# Altium schematic sheet FPGA.SchDoc: RNG RPI Interface
size 420 x 297 mm; Author: G.Kasprowicz; CompanyName: WUT ISE; DrawnBy: G.Kasprowicz; Organization: WUT ISE; Address1: PW ISE; Address2: Nowowiejska 15/19 00-665 Warsaw; Address3: gkasprow@gmail.com; Revision: 2; SheetNumber: -; SheetTotal: -; ModifiedBy: -; CheckedDate: -; Title2: FPGA banks; DivGrp: WUT ISE; Designer: G.Kasprowicz; ModifiedDate: -; ProjectName: Sensor Box
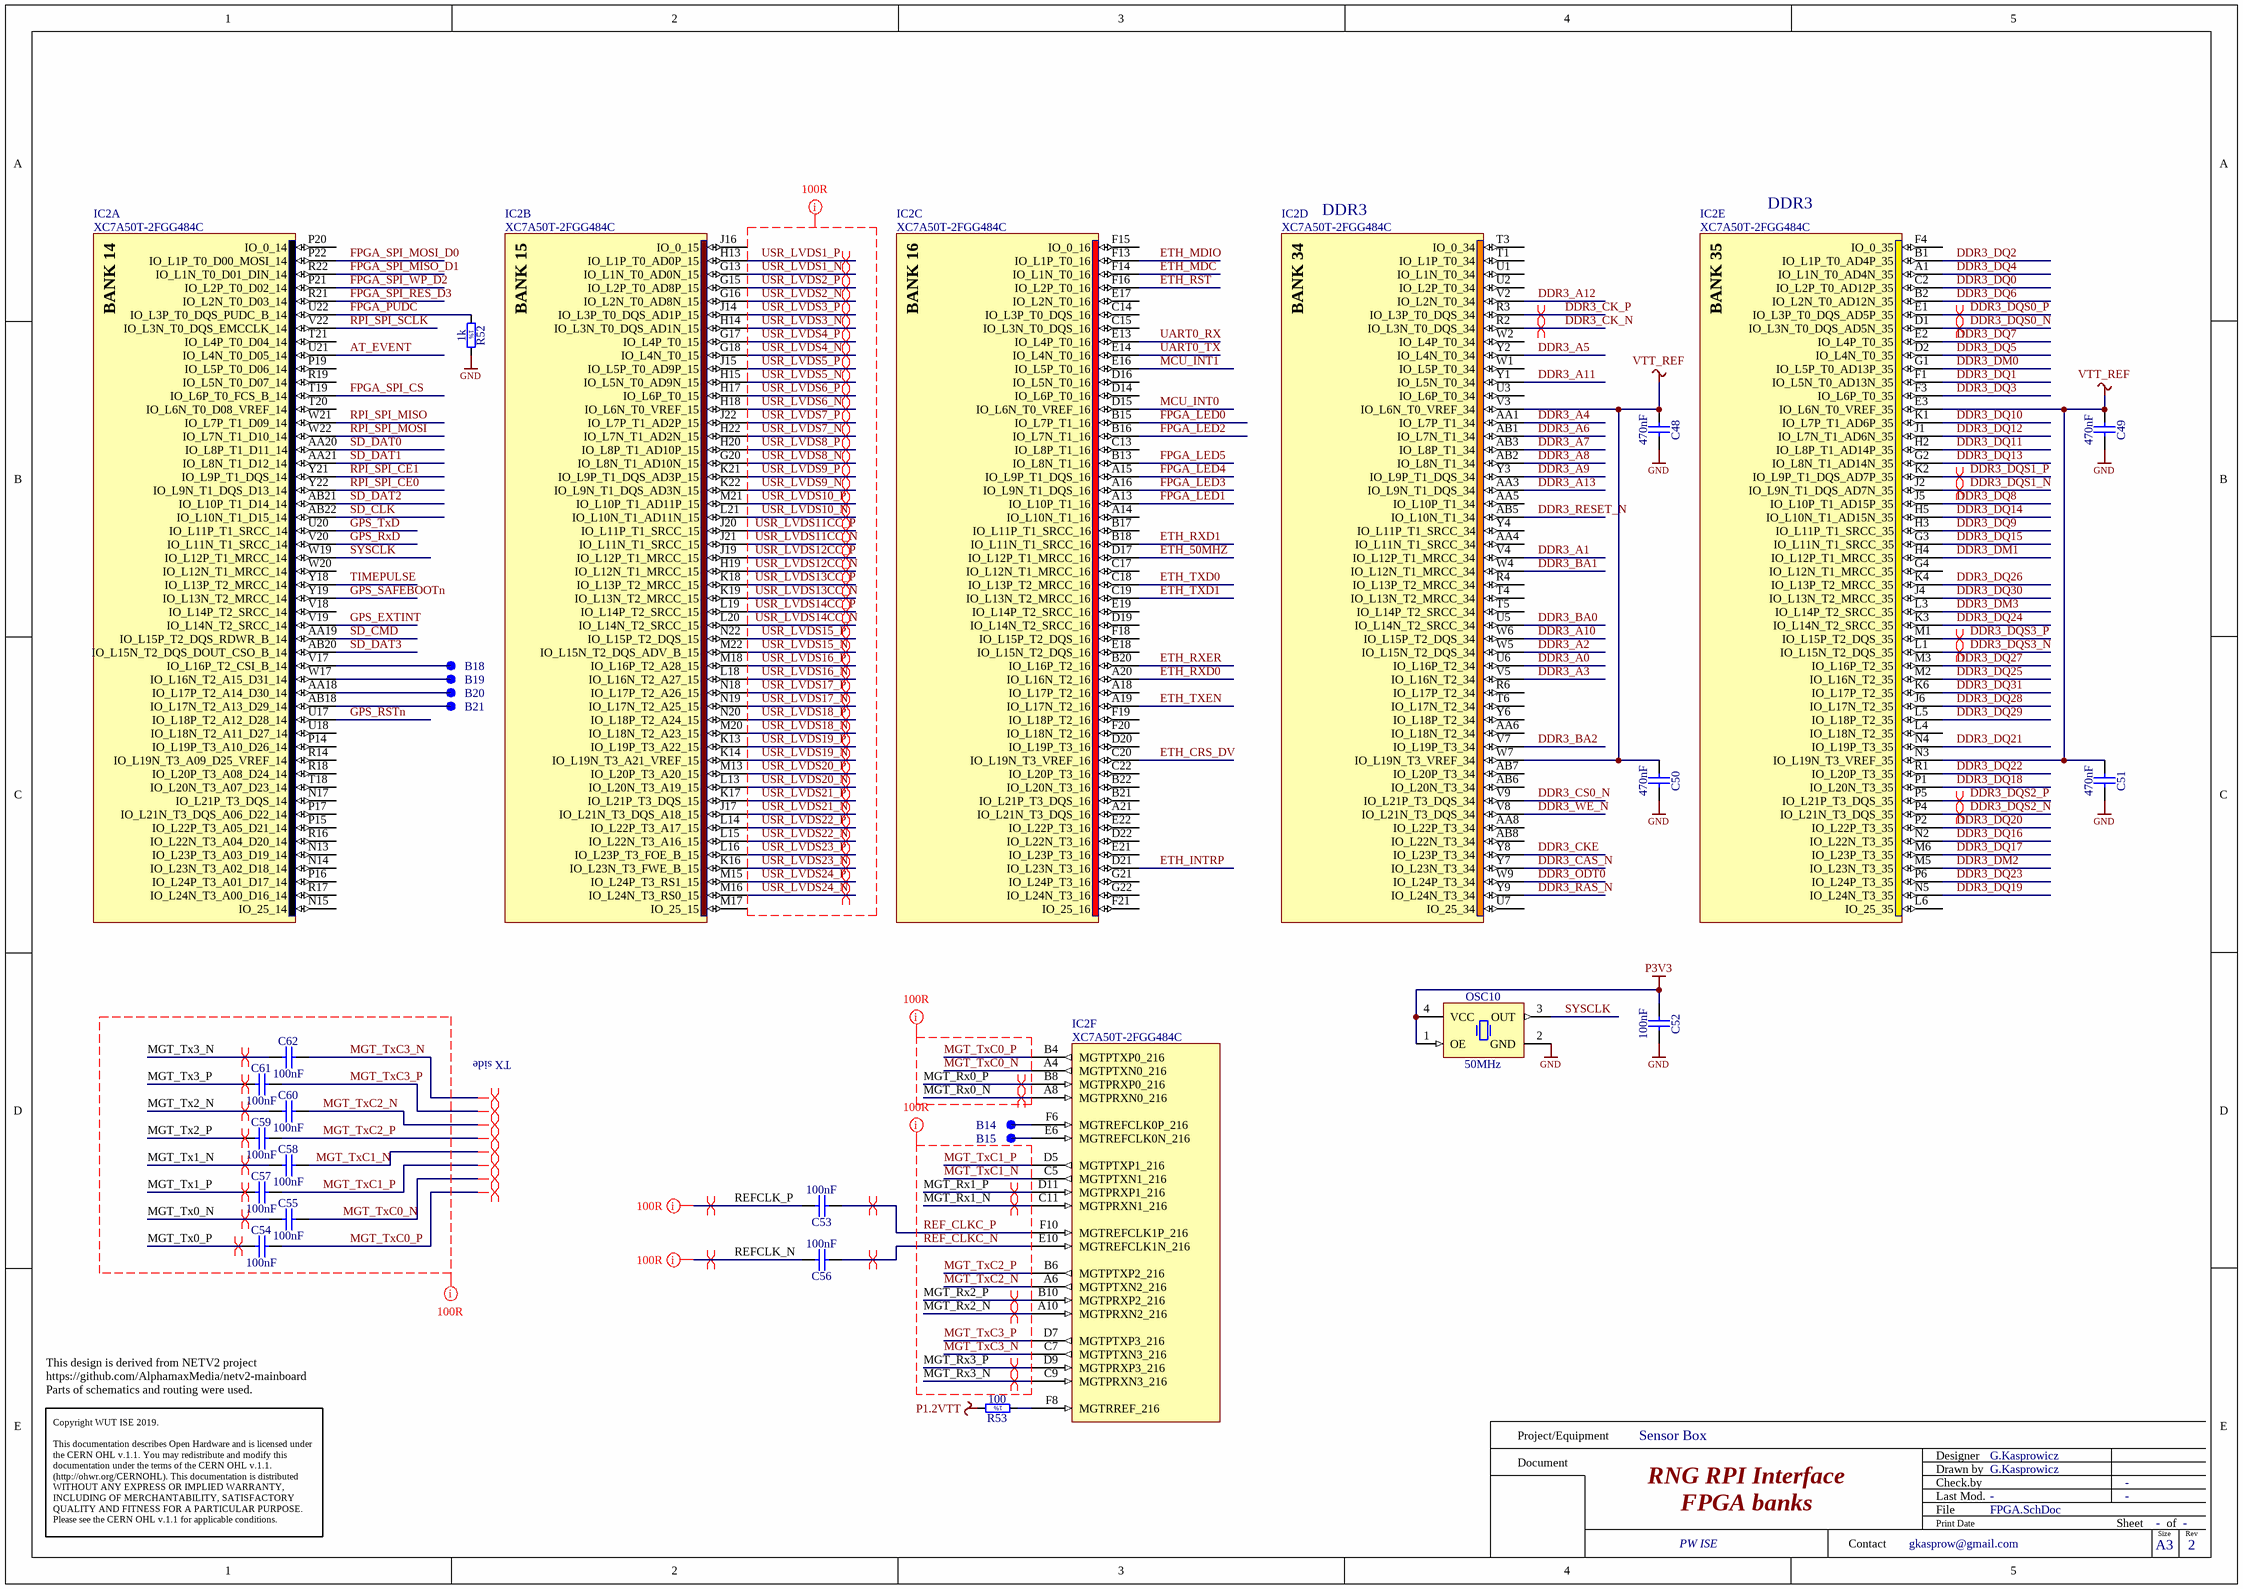
[diagram p0: FPGA.SchDoc]

## Parts
B14  SMD Pad  [C100]  (value not drawn)
B15  SMD Pad  [C100]  (value not drawn)
B18  SMD Pad  [C100]  (value not drawn)
B19  SMD Pad  [C100]  (value not drawn)
B20  SMD Pad  [C100]  (value not drawn)
B21  SMD Pad  [C100]  (value not drawn)
C48  470nF  [CAPC0603X33N]
C49  470nF  [CAPC0603X33N]
C50  470nF  [CAPC0603X33N]
C51  470nF  [CAPC0603X33N]
C52  100nF  [CAPC0603X33N]
C53  100nF  [CAPC0603X33N]
C54  100nF  [CAPC0603X33N]
C55  100nF  [CAPC0603X33N]
C56  100nF  [CAPC0603X33N]
C57  100nF  [CAPC0603X33N]
C58  100nF  [CAPC0603X33N]
C59  100nF  [CAPC0603X33N]
C60  100nF  [CAPC0603X33N]
C61  100nF  [CAPC0603X33N]
C62  100nF  [CAPC0603X33N]
IC2  XC7A50T-2FGG484C  [BGA484C100P22X22_2300X2300X260]  (parts A,B,C,D,E,F of 11)
OSC10  50MHz  [OSCSC254P320X500X130-4N]
R52  1k  [RESC1005X40N]
R53  100  [RESC1005X40N]

## Nets
GND: C48.2 C49.2 C50.2 C51.2 C52.2 OSC10.2(GND) R52.2
P1.2VTT: R53.2
P3V3: C52.1 OSC10.1(OE) OSC10.4(VCC)
VTT_REF: C48.1 C49.1 C50.1 C51.1 IC2.E3(IO_L6N_T0_VREF_35) IC2.N3(IO_L19N_T3_VREF_35) IC2.V3(IO_L6N_T0_VREF_34) IC2.W7(IO_L19N_T3_VREF_34)
AT_EVENT: IC2.U21(IO_L4N_T0_D05_14)
DDR3_A0: IC2.U6(IO_L16P_T2_34)
DDR3_A1: IC2.V4(IO_L12P_T1_MRCC_34)
DDR3_A2: IC2.W5(IO_L15N_T2_DQS_34)
DDR3_A3: IC2.V5(IO_L16N_T2_34)
DDR3_A4: IC2.AA1(IO_L7P_T1_34)
DDR3_A5: IC2.Y2(IO_L4N_T0_34)
DDR3_A6: IC2.AB1(IO_L7N_T1_34)
DDR3_A7: IC2.AB3(IO_L8P_T1_34)
DDR3_A8: IC2.AB2(IO_L8N_T1_34)
DDR3_A9: IC2.Y3(IO_L9P_T1_DQS_34)
DDR3_A10: IC2.W6(IO_L15P_T2_DQS_34)
DDR3_A11: IC2.Y1(IO_L5N_T0_34)
DDR3_A12: IC2.V2(IO_L2N_T0_34)
DDR3_A13: IC2.AA3(IO_L9N_T1_DQS_34)
DDR3_BA0: IC2.U5(IO_L14N_T2_SRCC_34)
DDR3_BA1: IC2.W4(IO_L12N_T1_MRCC_34)
DDR3_BA2: IC2.V7(IO_L19P_T3_34)
DDR3_CAS_N: IC2.Y7(IO_L23N_T3_34)
DDR3_CK_N: IC2.R2(IO_L3N_T0_DQS_34)
DDR3_CK_P: IC2.R3(IO_L3P_T0_DQS_34)
DDR3_CKE: IC2.Y8(IO_L23P_T3_34)
DDR3_CS0_N: IC2.V9(IO_L21P_T3_DQS_34)
DDR3_DM0: IC2.G1(IO_L5P_T0_AD13P_35)
DDR3_DM1: IC2.H4(IO_L12P_T1_MRCC_35)
DDR3_DM2: IC2.M5(IO_L23N_T3_35)
DDR3_DM3: IC2.L3(IO_L14P_T2_SRCC_35)
DDR3_DQ0: IC2.C2(IO_L2P_T0_AD12P_35)
DDR3_DQ1: IC2.F1(IO_L5N_T0_AD13N_35)
DDR3_DQ2: IC2.B1(IO_L1P_T0_AD4P_35)
DDR3_DQ3: IC2.F3(IO_L6P_T0_35)
DDR3_DQ4: IC2.A1(IO_L1N_T0_AD4N_35)
DDR3_DQ5: IC2.D2(IO_L4N_T0_35)
DDR3_DQ6: IC2.B2(IO_L2N_T0_AD12N_35)
DDR3_DQ7: IC2.E2(IO_L4P_T0_35)
DDR3_DQ8: IC2.J5(IO_L10P_T1_AD15P_35)
DDR3_DQ9: IC2.H3(IO_L11P_T1_SRCC_35)
DDR3_DQ10: IC2.K1(IO_L7P_T1_AD6P_35)
DDR3_DQ11: IC2.H2(IO_L8P_T1_AD14P_35)
DDR3_DQ12: IC2.J1(IO_L7N_T1_AD6N_35)
DDR3_DQ13: IC2.G2(IO_L8N_T1_AD14N_35)
DDR3_DQ14: IC2.H5(IO_L10N_T1_AD15N_35)
DDR3_DQ15: IC2.G3(IO_L11N_T1_SRCC_35)
DDR3_DQ16: IC2.N2(IO_L22N_T3_35)
DDR3_DQ17: IC2.M6(IO_L23P_T3_35)
DDR3_DQ18: IC2.P1(IO_L20N_T3_35)
DDR3_DQ19: IC2.N5(IO_L24N_T3_35)
DDR3_DQ20: IC2.P2(IO_L22P_T3_35)
DDR3_DQ21: IC2.N4(IO_L19P_T3_35)
DDR3_DQ22: IC2.R1(IO_L20P_T3_35)
DDR3_DQ23: IC2.P6(IO_L24P_T3_35)
DDR3_DQ24: IC2.K3(IO_L14N_T2_SRCC_35)
DDR3_DQ25: IC2.M2(IO_L16N_T2_35)
DDR3_DQ26: IC2.K4(IO_L13P_T2_MRCC_35)
DDR3_DQ27: IC2.M3(IO_L16P_T2_35)
DDR3_DQ28: IC2.J6(IO_L17N_T2_35)
DDR3_DQ29: IC2.L5(IO_L18P_T2_35)
DDR3_DQ30: IC2.J4(IO_L13N_T2_MRCC_35)
DDR3_DQ31: IC2.K6(IO_L17P_T2_35)
DDR3_DQS0_N: IC2.D1(IO_L3N_T0_DQS_AD5N_35)
DDR3_DQS0_P: IC2.E1(IO_L3P_T0_DQS_AD5P_35)
DDR3_DQS1_N: IC2.J2(IO_L9N_T1_DQS_AD7N_35)
DDR3_DQS1_P: IC2.K2(IO_L9P_T1_DQS_AD7P_35)
DDR3_DQS2_N: IC2.P4(IO_L21N_T3_DQS_35)
DDR3_DQS2_P: IC2.P5(IO_L21P_T3_DQS_35)
DDR3_DQS3_N: IC2.L1(IO_L15N_T2_DQS_35)
DDR3_DQS3_P: IC2.M1(IO_L15P_T2_DQS_35)
DDR3_ODT0: IC2.W9(IO_L24P_T3_34)
DDR3_RAS_N: IC2.Y9(IO_L24N_T3_34)
DDR3_RESET_N: IC2.AB5(IO_L10N_T1_34)
DDR3_WE_N: IC2.V8(IO_L21N_T3_DQS_34)
ETH_50MHZ: IC2.D17(IO_L12P_T1_MRCC_16)
ETH_CRS_DV: IC2.C20(IO_L19N_T3_VREF_16)
ETH_INTRP: IC2.D21(IO_L23N_T3_16)
ETH_MDC: IC2.F14(IO_L1N_T0_16)
ETH_MDIO: IC2.F13(IO_L1P_T0_16)
ETH_RST: IC2.F16(IO_L2P_T0_16)
ETH_RXD0: IC2.A20(IO_L16N_T2_16)
ETH_RXD1: IC2.B18(IO_L11N_T1_SRCC_16)
ETH_RXER: IC2.B20(IO_L16P_T2_16)
ETH_TXD0: IC2.C18(IO_L13P_T2_MRCC_16)
ETH_TXD1: IC2.C19(IO_L13N_T2_MRCC_16)
ETH_TXEN: IC2.A19(IO_L17N_T2_16)
FPGA_LED0: IC2.B15(IO_L7P_T1_16)
FPGA_LED1: IC2.A13(IO_L10P_T1_16)
FPGA_LED2: IC2.B16(IO_L7N_T1_16)
FPGA_LED3: IC2.A16(IO_L9N_T1_DQS_16)
FPGA_LED4: IC2.A15(IO_L9P_T1_DQS_16)
FPGA_LED5: IC2.B13(IO_L8N_T1_16)
FPGA_PUDC: IC2.U22(IO_L3P_T0_DQS_PUDC_B_14) R52.1
FPGA_SPI_CS: IC2.T19(IO_L6P_T0_FCS_B_14)
FPGA_SPI_MISO_D1: IC2.R22(IO_L1N_T0_D01_DIN_14)
FPGA_SPI_MOSI_D0: IC2.P22(IO_L1P_T0_D00_MOSI_14)
FPGA_SPI_RES_D3: IC2.R21(IO_L2N_T0_D03_14)
FPGA_SPI_WP_D2: IC2.P21(IO_L2P_T0_D02_14)
GPS_EXTINT: IC2.V19(IO_L14N_T2_SRCC_14)
GPS_RSTn: IC2.U17(IO_L18P_T2_A12_D28_14)
GPS_RxD: IC2.V20(IO_L11N_T1_SRCC_14)
GPS_SAFEBOOTn: IC2.Y19(IO_L13N_T2_MRCC_14)
GPS_TxD: IC2.U20(IO_L11P_T1_SRCC_14)
MCU_INT0: IC2.D15(IO_L6N_T0_VREF_16)
MCU_INT1: IC2.E16(IO_L5P_T0_16)
MGT_Rx0_N: IC2.A8(MGTPRXN0_216)
MGT_Rx0_P: IC2.B8(MGTPRXP0_216)
MGT_Rx1_N: IC2.C11(MGTPRXN1_216)
MGT_Rx1_P: IC2.D11(MGTPRXP1_216)
MGT_Rx2_N: IC2.A10(MGTPRXN2_216)
MGT_Rx2_P: IC2.B10(MGTPRXP2_216)
MGT_Rx3_N: IC2.C9(MGTPRXN3_216)
MGT_Rx3_P: IC2.D9(MGTPRXP3_216)
MGT_Tx0_N: C55.1
MGT_Tx0_P: C54.1
MGT_Tx1_N: C58.1
MGT_Tx1_P: C57.1
MGT_Tx2_N: C60.1
MGT_Tx2_P: C59.1
MGT_Tx3_N: C62.1
MGT_Tx3_P: C61.1
MGT_TxC0_N: C55.2 IC2.A4(MGTPTXN0_216)
MGT_TxC0_P: C54.2 IC2.B4(MGTPTXP0_216)
MGT_TxC1_N: C58.2 IC2.C5(MGTPTXN1_216)
MGT_TxC1_P: C57.2 IC2.D5(MGTPTXP1_216)
MGT_TxC2_N: C60.2 IC2.A6(MGTPTXN2_216)
MGT_TxC2_P: C59.2 IC2.B6(MGTPTXP2_216)
MGT_TxC3_N: C62.2 IC2.C7(MGTPTXN3_216)
MGT_TxC3_P: C61.2 IC2.D7(MGTPTXP3_216)
REF_CLKC_N: C56.1 IC2.E10(MGTREFCLK1N_216)
REF_CLKC_P: C53.1 IC2.F10(MGTREFCLK1P_216)
REFCLK_N: C56.2
REFCLK_P: C53.2
RPI_SPI_CE0: IC2.Y22(IO_L9N_T1_DQS_D13_14)
RPI_SPI_CE1: IC2.Y21(IO_L9P_T1_DQS_14)
RPI_SPI_MISO: IC2.W21(IO_L7P_T1_D09_14)
RPI_SPI_MOSI: IC2.W22(IO_L7N_T1_D10_14)
RPI_SPI_SCLK: IC2.V22(IO_L3N_T0_DQS_EMCCLK_14)
SD_CLK: IC2.AB22(IO_L10N_T1_D15_14)
SD_CMD: IC2.AA19(IO_L15P_T2_DQS_RDWR_B_14)
SD_DAT0: IC2.AA20(IO_L8P_T1_D11_14)
SD_DAT1: IC2.AA21(IO_L8N_T1_D12_14)
SD_DAT2: IC2.AB21(IO_L10P_T1_D14_14)
SD_DAT3: IC2.AB20(IO_L15N_T2_DQS_DOUT_CSO_B_14)
SYSCLK: IC2.W19(IO_L12P_T1_MRCC_14) OSC10.3(OUT)
TIMEPULSE: IC2.Y18(IO_L13P_T2_MRCC_14)
UART0_RX: IC2.E13(IO_L4P_T0_16)
UART0_TX: IC2.E14(IO_L4N_T0_16)
USR_LVDS1_N: IC2.G13(IO_L1N_T0_AD0N_15)
USR_LVDS1_P: IC2.H13(IO_L1P_T0_AD0P_15)
USR_LVDS2_N: IC2.G16(IO_L2N_T0_AD8N_15)
USR_LVDS2_P: IC2.G15(IO_L2P_T0_AD8P_15)
USR_LVDS3_N: IC2.H14(IO_L3N_T0_DQS_AD1N_15)
USR_LVDS3_P: IC2.J14(IO_L3P_T0_DQS_AD1P_15)
USR_LVDS4_N: IC2.G18(IO_L4N_T0_15)
USR_LVDS4_P: IC2.G17(IO_L4P_T0_15)
USR_LVDS5_N: IC2.H15(IO_L5N_T0_AD9N_15)
USR_LVDS5_P: IC2.J15(IO_L5P_T0_AD9P_15)
USR_LVDS6_N: IC2.H18(IO_L6N_T0_VREF_15)
USR_LVDS6_P: IC2.H17(IO_L6P_T0_15)
USR_LVDS7_N: IC2.H22(IO_L7N_T1_AD2N_15)
USR_LVDS7_P: IC2.J22(IO_L7P_T1_AD2P_15)
USR_LVDS8_N: IC2.G20(IO_L8N_T1_AD10N_15)
USR_LVDS8_P: IC2.H20(IO_L8P_T1_AD10P_15)
USR_LVDS9_N: IC2.K22(IO_L9N_T1_DQS_AD3N_15)
USR_LVDS9_P: IC2.K21(IO_L9P_T1_DQS_AD3P_15)
USR_LVDS10_N: IC2.L21(IO_L10N_T1_AD11N_15)
USR_LVDS10_P: IC2.M21(IO_L10P_T1_AD11P_15)
USR_LVDS11CC_N: IC2.J21(IO_L11N_T1_SRCC_15)
USR_LVDS11CC_P: IC2.J20(IO_L11P_T1_SRCC_15)
USR_LVDS12CC_N: IC2.H19(IO_L12N_T1_MRCC_15)
USR_LVDS12CC_P: IC2.J19(IO_L12P_T1_MRCC_15)
USR_LVDS13CC_N: IC2.K19(IO_L13N_T2_MRCC_15)
USR_LVDS13CC_P: IC2.K18(IO_L13P_T2_MRCC_15)
USR_LVDS14CC_N: IC2.L20(IO_L14N_T2_SRCC_15)
USR_LVDS14CC_P: IC2.L19(IO_L14P_T2_SRCC_15)
USR_LVDS15_N: IC2.M22(IO_L15N_T2_DQS_ADV_B_15)
USR_LVDS15_P: IC2.N22(IO_L15P_T2_DQS_15)
USR_LVDS16_N: IC2.L18(IO_L16N_T2_A27_15)
USR_LVDS16_P: IC2.M18(IO_L16P_T2_A28_15)
USR_LVDS17_N: IC2.N19(IO_L17N_T2_A25_15)
USR_LVDS17_P: IC2.N18(IO_L17P_T2_A26_15)
USR_LVDS18_N: IC2.M20(IO_L18N_T2_A23_15)
USR_LVDS18_P: IC2.N20(IO_L18P_T2_A24_15)
USR_LVDS19_N: IC2.K14(IO_L19N_T3_A21_VREF_15)
USR_LVDS19_P: IC2.K13(IO_L19P_T3_A22_15)
USR_LVDS20_N: IC2.L13(IO_L20N_T3_A19_15)
USR_LVDS20_P: IC2.M13(IO_L20P_T3_A20_15)
USR_LVDS21_N: IC2.J17(IO_L21N_T3_DQS_A18_15)
USR_LVDS21_P: IC2.K17(IO_L21P_T3_DQS_15)
USR_LVDS22_N: IC2.L15(IO_L22N_T3_A16_15)
USR_LVDS22_P: IC2.L14(IO_L22P_T3_A17_15)
USR_LVDS23_N: IC2.K16(IO_L23N_T3_FWE_B_15)
USR_LVDS23_P: IC2.L16(IO_L23P_T3_FOE_B_15)
USR_LVDS24_N: IC2.M16(IO_L24N_T3_RS0_15)
USR_LVDS24_P: IC2.M15(IO_L24P_T3_RS1_15)
NetB14_1: B14.1 IC2.F6(MGTREFCLK0P_216)
NetB15_1: B15.1 IC2.E6(MGTREFCLK0N_216)
NetB18_1: B18.1 IC2.V17(IO_L16P_T2_CSI_B_14)
NetB19_1: B19.1 IC2.W17(IO_L16N_T2_A15_D31_14)
NetB20_1: B20.1 IC2.AA18(IO_L17P_T2_A14_D30_14)
NetB21_1: B21.1 IC2.AB18(IO_L17N_T2_A13_D29_14)
NetIC2_F8: IC2.F8(MGTRREF_216) R53.1

Not connected (* = marked no-connect by the designer): IC2 A14(IO_L10N_T1_16) A18(IO_L17P_T2_16) A21(IO_L21N_T3_DQS_16) AA4(IO_L11N_T1_SRCC_34) AA5(IO_L10P_T1_34) AA6(IO_L18N_T2_34) AA8(IO_L22P_T3_34) AB6(IO_L20N_T3_34) AB7(IO_L20P_T3_34) AB8(IO_L22N_T3_34) B17(IO_L11P_T1_SRCC_16) B21(IO_L21P_T3_DQS_16) B22(IO_L20N_T3_16) C13(IO_L8P_T1_16) C14(IO_L3P_T0_DQS_16) C15(IO_L3N_T0_DQS_16) C17(IO_L12N_T1_MRCC_16) C22(IO_L20P_T3_16) D14(IO_L6P_T0_16) D16(IO_L5N_T0_16) D19(IO_L14N_T2_SRCC_16) D20(IO_L19P_T3_16) D22(IO_L22N_T3_16) E17(IO_L2N_T0_16) E18(IO_L15N_T2_DQS_16) E19(IO_L14P_T2_SRCC_16) E21(IO_L23P_T3_16) E22(IO_L22P_T3_16) F4(IO_0_35) F15(IO_0_16) F18(IO_L15P_T2_DQS_16) F19(IO_L18P_T2_16) F20(IO_L18N_T2_16) F21(IO_25_16) G4(IO_L12N_T1_MRCC_35) G21(IO_L24P_T3_16) G22(IO_L24N_T3_16) J16(IO_0_15) L4(IO_L18N_T2_35) L6(IO_25_35) M17(IO_25_15) N13(IO_L23P_T3_A03_D19_14) N14(IO_L23N_T3_A02_D18_14) N15(IO_25_14) N17(IO_L21P_T3_DQS_14) P14(IO_L19P_T3_A10_D26_14) P15(IO_L22P_T3_A05_D21_14) P16(IO_L24P_T3_A01_D17_14) P17(IO_L21N_T3_DQS_A06_D22_14) P19(IO_L5P_T0_D06_14) P20(IO_0_14) R4(IO_L13P_T2_MRCC_34) R6(IO_L17P_T2_34) R14(IO_L19N_T3_A09_D25_VREF_14) R16(IO_L22N_T3_A04_D20_14) R17(IO_L24N_T3_A00_D16_14) R18(IO_L20P_T3_A08_D24_14) R19(IO_L5N_T0_D07_14) T1(IO_L1P_T0_34) T3(IO_0_34) T4(IO_L13N_T2_MRCC_34) T5(IO_L14P_T2_SRCC_34) T6(IO_L17N_T2_34) T18(IO_L20N_T3_A07_D23_14) T20(IO_L6N_T0_D08_VREF_14) T21(IO_L4P_T0_D04_14) U1(IO_L1N_T0_34) U2(IO_L2P_T0_34) U3(IO_L6P_T0_34) U7(IO_25_34) U18(IO_L18N_T2_A11_D27_14) V18(IO_L14P_T2_SRCC_14) W1(IO_L5P_T0_34) W2(IO_L4P_T0_34) W20(IO_L12N_T1_MRCC_14) Y4(IO_L11P_T1_SRCC_34) Y6(IO_L18P_T2_34)

## Layout directives
differential pair: DDR3_CK_N, DDR3_CK_P, DDR3_DQS0_N, DDR3_DQS0_P, DDR3_DQS1_N, DDR3_DQS1_P, DDR3_DQS2_N, DDR3_DQS2_P, DDR3_DQS3_N, DDR3_DQS3_P, MGT_Rx0_N, MGT_Rx0_P, MGT_Rx1_N, MGT_Rx1_P, MGT_Rx2_N, MGT_Rx2_P, MGT_Rx3_N, MGT_Rx3_P, MGT_Tx0_N, MGT_Tx0_P, MGT_Tx1_N, MGT_Tx1_P, MGT_Tx2_N, MGT_Tx2_P, MGT_Tx3_N, MGT_Tx3_P, MGT_TxC0_N, MGT_TxC0_P, MGT_TxC1_N, MGT_TxC1_P, MGT_TxC2_N, MGT_TxC2_P, MGT_TxC3_N, MGT_TxC3_P, REF_CLKC_N, REF_CLKC_P, REFCLK_N, REFCLK_P, USR_LVDS1_N, USR_LVDS1_P, USR_LVDS2_N, USR_LVDS2_P, USR_LVDS3_N, USR_LVDS3_P, USR_LVDS4_N, USR_LVDS4_P, USR_LVDS5_N, USR_LVDS5_P, USR_LVDS6_N, USR_LVDS6_P, USR_LVDS7_N, USR_LVDS7_P, USR_LVDS8_N, USR_LVDS8_P, USR_LVDS9_N, USR_LVDS9_P, USR_LVDS10_N, USR_LVDS10_P, USR_LVDS11CC_N, USR_LVDS11CC_P, USR_LVDS12CC_N, USR_LVDS12CC_P, USR_LVDS13CC_N, USR_LVDS13CC_P, USR_LVDS14CC_N, USR_LVDS14CC_P, USR_LVDS15_N, USR_LVDS15_P, USR_LVDS16_N, USR_LVDS16_P, USR_LVDS17_N, USR_LVDS17_P, USR_LVDS18_N, USR_LVDS18_P, USR_LVDS19_N, USR_LVDS19_P, USR_LVDS20_N, USR_LVDS20_P, USR_LVDS21_N, USR_LVDS21_P, USR_LVDS22_N, USR_LVDS22_P, USR_LVDS23_N, USR_LVDS23_P, USR_LVDS24_N, USR_LVDS24_P
net class Z100R: MGT_Rx0_N, MGT_Rx0_P, MGT_Rx1_N, MGT_Rx1_P, MGT_Rx2_N, MGT_Rx2_P, MGT_Rx3_N, MGT_Rx3_P, MGT_Tx0_N, MGT_Tx0_P, MGT_Tx1_N, MGT_Tx1_P, MGT_Tx2_N, MGT_Tx2_P, MGT_Tx3_N, MGT_Tx3_P, MGT_TxC0_N, MGT_TxC0_P, MGT_TxC1_N, MGT_TxC1_P, MGT_TxC2_N, MGT_TxC2_P, MGT_TxC3_N, MGT_TxC3_P, REF_CLKC_N, REF_CLKC_P, REFCLK_N, REFCLK_P, USR_LVDS1_N, USR_LVDS1_P, USR_LVDS2_N, USR_LVDS2_P, USR_LVDS3_N, USR_LVDS3_P, USR_LVDS4_N, USR_LVDS4_P, USR_LVDS5_N, USR_LVDS5_P, USR_LVDS6_N, USR_LVDS6_P, USR_LVDS7_N, USR_LVDS7_P, USR_LVDS8_N, USR_LVDS8_P, USR_LVDS9_N, USR_LVDS9_P, USR_LVDS10_N, USR_LVDS10_P, USR_LVDS11CC_N, USR_LVDS11CC_P, USR_LVDS12CC_N, USR_LVDS12CC_P, USR_LVDS13CC_N, USR_LVDS13CC_P, USR_LVDS14CC_N, USR_LVDS14CC_P, USR_LVDS15_N, USR_LVDS15_P, USR_LVDS16_N, USR_LVDS16_P, USR_LVDS17_N, USR_LVDS17_P, USR_LVDS18_N, USR_LVDS18_P, USR_LVDS19_N, USR_LVDS19_P, USR_LVDS20_N, USR_LVDS20_P, USR_LVDS21_N, USR_LVDS21_P, USR_LVDS22_N, USR_LVDS22_P, USR_LVDS23_N, USR_LVDS23_P, USR_LVDS24_N, USR_LVDS24_P

## Notes on the sheet
- DDR3
- TX side
- This design is derived from NETV2 project
  https://github.com/AlphamaxMedia/netv2-mainboard
  Parts of schematics and routing were used.
- Project/Equipment
- Document
- Designer
- Drawn by
- Check.by
- Copyright WUT ISE 2019.
  This documentation describes Open Hardware and is licensed under the CERN OHL v.1.1. You may redistribute and modify this documentation under the terms of the CERN OHL v.1.1. (http://ohwr.org/CERNOHL). This documentation is distributed WITHOUT ANY EXPRESS OR IMPLIED WARRANTY, INCLUDING OF MERCHANTABILITY, SATISFACTORY QUALITY AND FITNESS FOR A PARTICULAR PURPOSE. Please see the CERN OHL v.1.1 for applicable conditions.
- Contact
- File
- Last Mod.
- Print Date
- Sheet
- Size
- A3
- of
- Rev
- (in symbol R0402_1K_1%_0.0625W_100PPM) 1%
- (in symbol R0402_100R_1%_0.1W_100PPM) 1%
- (in symbol XC7A50T-2FGG484C, part A) BANK 14
- (in symbol XC7A50T-2FGG484C, part B) BANK 15
- (in symbol XC7A50T-2FGG484C, part C) BANK 16
- (in symbol XC7A50T-2FGG484C, part D) BANK 34
- (in symbol XC7A50T-2FGG484C, part E) BANK 35

## Library data of the parts
B14 B15 B18-B21 = SMD_PAD_D1MM: Through Hole Pad; Part Description: 1mm Diameter SMD Pad; Mounted: No; Part Number: SMD_PAD_D1MM; Component Kind: Standard (No BOM); Component Type: Standard (No BOM); Pin Count: 1; Family: SMD Pad; Socket: No; SMD: No; Sense: No; Status: None; ComponentHeight: 0mm; HelpURL: Undefined; Author: CERN DEM JLC; CreateDate: 10.10.2017; LatestRevisionDate: 10.10.2017; PackageDescription: 1mm Diameter SMD Pad
C48-C51 = CC0201_470NF_4V_20%_X5R: Non-polarised capacitor; Part Description: SMD Multilayer Chip Ceramic Capacitor; Manufacturer: GENERIC; Manufacturer1 Part Number: AMK063BJ474MP-F; Voltage: 4V; TC: X5R; Tolerance: ±20%; Part Number: CC0201_470NF_4V_20%_X5R; Component Kind: Standard; Component Type: Standard; Pin Count: 2; Value: 470nF; Status: Not Recommended; Manufacturer Part Number: CC0201_470NF_4V_20%_X5R; Case: 0201; Mounted: Yes; Socket: No; SMD: Yes; Sense: No; Manufacturer1 Example: TAIYO YUDEN; Manufacturer1 ComponentHeight: 0.33mm; HelpURL: \\cern.ch\dfs\Applications\Altium\Datasheets\CC0201_X5R_TAIYO-YUDEN_STANDARD-CLASS2.pdf; Author: CERN DEM JLC; CreateDate: 27.05.2010; LatestRevisionDate: 27.05.2010
C52-C62 = CC0201_100NF_6.3V_10%_X5R: Non-polarised capacitor; Part Description: SMD Multilayer Chip Ceramic Capacitor; Manufacturer: GENERIC; Manufacturer1 Part Number: 02016D104KAT2A; Voltage: 6.3V; TC: X5R; Tolerance: ±10%; Part Number: CC0201_100NF_6.3V_10%_X5R; Component Kind: Standard; Component Type: Standard; Pin Count: 2; Value: 100nF; Status: Not Recommended; Manufacturer Part Number: CC0201_100NF_6.3V_10%_X5R; Case: 0201; Mounted: Yes; Socket: No; SMD: Yes; Sense: No; Manufacturer1 Example: AVX; Manufacturer1 ComponentHeight: 0.33mm; HelpURL: \\cern.ch\dfs\Applications\Altium\Datasheets\CC0201_X5R_AVX.pdf; Author: CERN DEM JLC; CreateDate: 03.12.2007; LatestRevisionDate: 03.12.2007
IC2 = XC7A50T-2FGG484C: Artix-7 FPGA, 4 GTPs, 250 User I/Os, 484-Ball Fine-Pitch Thin BGA (1.0mm Pitch), Speed Grade 2, Commercial Grade, Pb-Free; Manufacturer: XILINX; PressFit: No; Bonding: No; Part Number: XC7A50T-2FGG484C; Component Kind: Standard; Component Type: Standard; Device: XC7A50T-2FGG484C; PackageDescription: BGA, 1.00mm Pitch, Square; 484 Pin, 22 Columns x 22 Rows, Body 23mm X 23mm X 2.60mm H, IPC Medium Density; Part Description: Artix-7 FPGA, 4 GTPs, 250 User I/Os, 484-Ball Fine-Pitch Thin BGA (1.0mm Pitch), Speed Grade 2, Commercial Grade, Pb-Free; Manufacturer Part Number: XC7A50T-2FGG484C; Pin Count: 484; Case: BGA484; Mounted: Yes; Socket: No; SMD: Yes; Sense: No; ComponentHeight: 2.6mm; HelpURL: \\cern.ch\dfs\Applications\Altium\Datasheets\XC7A50T-2FGG484C.pdf; ComponentLink1URL: \\cern.ch\dfs\Applications\Altium\Datasheets\XC7A50T-2FGG484C_Package-Pinout.pdf; ComponentLink1Description: Package/Pinout; Author: CERN DEM JMW; CreateDate: 26.07.2018; LatestRevisionDate: 26.07.2018
OSC10 = OSC_50MHZ_CTS_636L3I050M00000: Oscillator 4 pins 1=OE 2=GND 3=OUT 4=VCC; Part Description: 3.3V, ±50ppm, 30pF, -40..85°C, HCMOS/TTL Clock Oscillator, 636 Series; Manufacturer: CTS ELECTRONIC COMPONENTS; PressFit: No; Bonding: No; Part Number: OSC_50MHZ_CTS_636L3I050M00000; Component Kind: Standard; Component Type: Standard; PackageDescription: Oscillator, Side Concave; 2.54mm Pitch; 4 pin, 3.20mm L X 5.00mm W X 1.30mm H, IPC Medium Density; Value: 50MHz; Manufacturer Part Number: 636L3I050M00000; Pin Count: 4; Mounted: Yes; Socket: No; SMD: Yes; Sense: No; ComponentHeight: 1.3mm; HelpURL: \\cern.ch\dfs\Applications\Altium\Datasheets\OSC_CTS_636.pdf; Author: CERN DEM JMW; CreateDate: 22.09.2015; LatestRevisionDate: 22.09.2015
R52 = R0402_1K_1%_0.0625W_100PPM: Resistor - 1%; Part Description: General Purpose Thick Film Chip Resistor; Manufacturer: GENERIC; Manufacturer1 Part Number: 232270671002L; TC: ±100ppm/°C; PressFit: No; Part Number: R0402_1K_1%_0.0625W_100PPM; Component Kind: Standard; Component Type: Standard; Pin Count: 2; Value: 1k; Status: Not Recommended; Power: 0.0625W; Tolerance: ±1%; Manufacturer Part Number: R0402_1K_1%_0.0625W_100PPM; Case: 0402; Mounted: Yes; Sense: No; Socket: No; SMD: Yes; Manufacturer1 Example: YAGEO PHYCOMP; Manufacturer1 ComponentHeight: 0.4mm; HelpURL: \\cern.ch\dfs\Applications\Altium\Datasheets\R0402_Phycomp_RC0402.pdf; Author: CERN DEM JLC; CreateDate: 03.12.2007; LatestRevisionDate: 17.10.2012
R53 = R0402_100R_1%_0.1W_100PPM: Resistor - 1%; Part Description: General Purpose Thick Film Chip Resistor; Manufacturer: GENERIC; Manufacturer Part Number: R0402_100R_1%_0.1W_100PPM_50V; Manufacturer1 Part Number: ERJ2RKF1000X; Power: 0.1W; TC: ±100ppm/°C; Voltage: 50V; PressFit: No; Part Number: R0402_100R_1%_0.1W_100PPM; Component Kind: Standard; Component Type: Standard; Pin Count: 2; Value: 100; Status: Not Recommended; Tolerance: ±1%; Case: 0402; Mounted: Yes; Sense: No; Socket: No; SMD: Yes; Manufacturer1 Example: PANASONIC; Manufacturer1 ComponentHeight: 0.4mm; HelpURL: \\cern.ch\dfs\Applications\Altium\Datasheets\R0402_PANASONIC_ERJ2RK.pdf; Author: CERN DEM JLC; CreateDate: 12.12.2013; LatestRevisionDate: 03.03.2015